# Altium project AS5600.PrjPcb
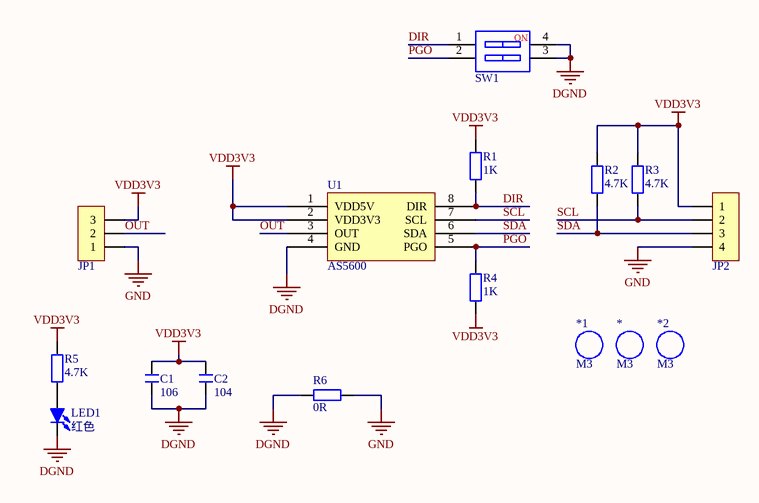
[diagram p0: Sheet1.SchDoc]
1 sheet, 16 parts. Net scope: global (net labels, ports and power ports of the same name join across sheets).
Board file: AS5600.PcbDoc

## Sheet Sheet1.SchDoc
size A4

### Parts
*  M3  [M3 125X200]
*1  M3  [M3 125X200]
*2  M3  [M3 125X200]
C1  106  [C 0603_M]
C2  104  [C 0603_M]
JP1  HDR-1X3  [MX 1.25-WS-3P]  (value not drawn)
JP2  HDR-1X4  [MX 1.25-WS-4P]  (value not drawn)
LED1  红色  [LED 0603G]
R1  1K  [R 0805_L]
R2  4.7K  [R 0805_L]
R3  4.7K  [R 0805_L]
R4  1K  [R 0805_L]
R5  4.7K  [R 0805_L]
R6  0R  [R 0603_L]
SW1  CSW-2P  [CSW1.27 SMD-2P]  (value not drawn)
U1  AS5600  [SOIC_8]

### Nets
DGND: C1.1 C2.1 LED1.2(K) R6.1 SW1.3 SW1.4 U1.4(GND)
GND: JP1.1 JP2.4 R6.2
VDD3V3: C1.2 C2.2 JP1.3 JP2.1 R1.2 R2.2 R3.2 R4.1 R5.2 U1.1(VDD5V) U1.2(VDD3V3)
DIR: R1.1 SW1.1 U1.8(DIR)
OUT: JP1.2 U1.3(OUT)
PGO: R4.2 SW1.2 U1.5(PGO)
SCL: JP2.2 R3.1 U1.7(SCL)
SDA: JP2.3 R2.1 U1.6(SDA)
NetLED1_1: LED1.1(A) R5.1

### Notes on the sheet
- (in symbol CSW-2P) NO

### Library data of the parts
* *1 *2 = M3: 铜柱孔; 版权归属: 源创客; BOM名称: 铜柱孔; 学习资源: www.ooocke.com
C1 C2 = C: 无极性贴片电容; 版权归属: 源创客; BOM名称: 无极性贴片电容; 学习资源: www.ooocke.com
JP1 = Header 3: 3P接插件; 版权归属: 源创客; BOM名称: 3P接插件; 学习资源: www.ooocke.com
JP2 = Header 4: 4P接插件; 版权归属: 源创客; BOM名称: 4P接插件; 学习资源: www.ooocke.com
LED1 = LED-SMD: 贴片LED; 版权归属: 源创客; BOM名称: 贴片LED; 学习资源: www.ooocke.com
R1-R6 = R: 贴片电阻; 版权归属: 源创客; BOM名称: 贴片电阻; 学习资源: www.ooocke.com
SW1 = CSW-2P: 2路编码开关; 版权归属: 源创客; BOM名称: 2路编码开关; 学习资源: www.ooocke.com